# Altium schematic sheet SymphonyLights_SOC.SchDoc
size A4
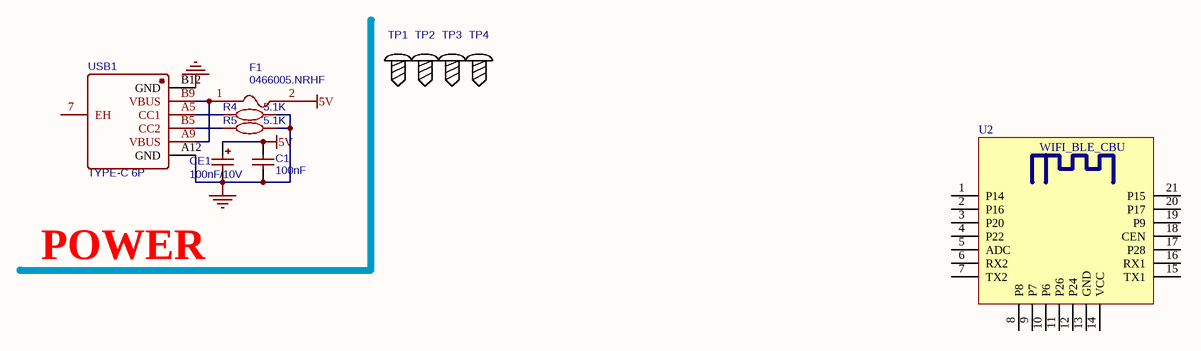
[diagram p0: SymphonyLights_SOC.SchDoc]

## Parts
C1  100nF  [0805C]
CE1  100nF/10V  [EC2.5/6]
F1  0466005.NRHF  [1206F]
R4  5.1K  [0805R]
R5  5.1K  [0805R]
TP1  (no value)  [M3螺丝孔]
TP2  (no value)  [M3螺丝孔]
TP3  (no value)  [M3螺丝孔]
TP4  (no value)  [M3螺丝孔]
U2  WIFI_BLE_CBU  [WIFI_BLE_CBU]  (value not drawn)
USB1  TYPE-C 6P  [TYPE-C-SMD_TYPE-C-6P]

## Nets
5V: C1.2 CE1.1 F1.2
GND: C1.1 CE1.2 R4.2 R5.2 USB1.A12(GND) USB1.B12(GND)
NetF1_1: F1.1 USB1.A9(VBUS) USB1.B9(VBUS)
NetR4_1: R4.1 USB1.A5(CC1)
NetR5_1: R5.1 USB1.B5(CC2)

Not connected (* = marked no-connect by the designer): U2 1(P14) 2(P16) 3(P20) 4(P22) 5(ADC) 6(RX2) 7(TX2) 8(P8) 9(P7) 10(P6) 11(P26) 12(P24) 13(GND) 14(VCC) 15(TX1) 16(RX1) 17(P28) 18(CEN) 19(P9) 20(P17) 21(P15); USB1 7(EH)

## Notes on the sheet
- POWER

## Library data of the parts
C1 = 100nF: BOM_Manufacturer: FH; BOM_Manufacturer Part: 0805B104K500NT; nameAlias: Capacitance; BOM_Supplier: LCSC; BOM_Supplier Part: C38141; spicePre: C; spiceSymbolName: 0805B104K500NT
CE1 = 0.1uF: BOM_Manufacturer: CEC; BOM_Manufacturer Part: CA45-A-10V-22uF-K; nameAlias: Capacitance; Contributor: LCSC; SMT Type: Extend; Package Display: No; BOM_Supplier: LCSC; BOM_Supplier Part: C129272; BOM_LCSC Assembly: Yes; spicePre: C; spiceSymbolName: CA45-A-10V-22UF-K
F1 = 0466005.NRHF: BOM_Manufacturer: Littelfuse; BOM_Supplier: LCSC; BOM_Manufacturer Part: 0466005.NRHF; BOM_Supplier Part: C57525; spicePre: F; spiceSymbolName: 0466005.NRHF
R4 R5 = 10K: BOM_Manufacturer: ResistorToday; BOM_Manufacturer Part: AECR0402F10K0K9; nameAlias: Resistance (Ohms); Contributor: LCSC; Package Display: No; BOM_Supplier: LCSC; BOM_Supplier Part: C328298; spicePre: R; spiceSymbolName: AECR0402F10K0K9
TP1-TP4 = (no symbol name): Contributor: 455553Z; spicePre: T
U2 = WIFI_BLE_CBU: Module
USB1 = TYPE-C 6P(073): BOM_Manufacturer: SHOU HAN; Contributor: LCSC; BOM_Supplier: LCSC; BOM_Supplier Part: C668623; BOM_Manufacturer Part: TYPE-C 6P(073); spicePre: U; spiceSymbolName: TYPE-C 6P(073)